# Altium schematic sheet My_lib.SchDoc
size A4
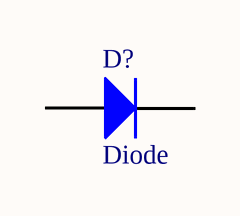
[diagram p0: My_lib.SchDoc]

## Parts
D?  Diode  [DSO-C2/X3.3]

## Nets

Not connected (* = marked no-connect by the designer): D? 1(A) 2(K)

## Library data of the parts
D? = Diode: Default Diode; Published: 8-Jun-2000; LatestRevisionDate: 17-Jul-2002; LatestRevisionNote: Re-released for DXP Platform.; PackageVersion: Sep-1996; PackageReference: SMC; Publisher: Altium Limited; Code_JEDEC: DO-214-AB